# EAGLE schematic d-cube (EAGLE 9.2.1)

## Sheet 1 of 4: Isolation Circuits for USB, Power between the Target and the RPI as well as the power switch for the Target. A 3.3V Voltage for the isolators is also derived from the isolated 5V power.
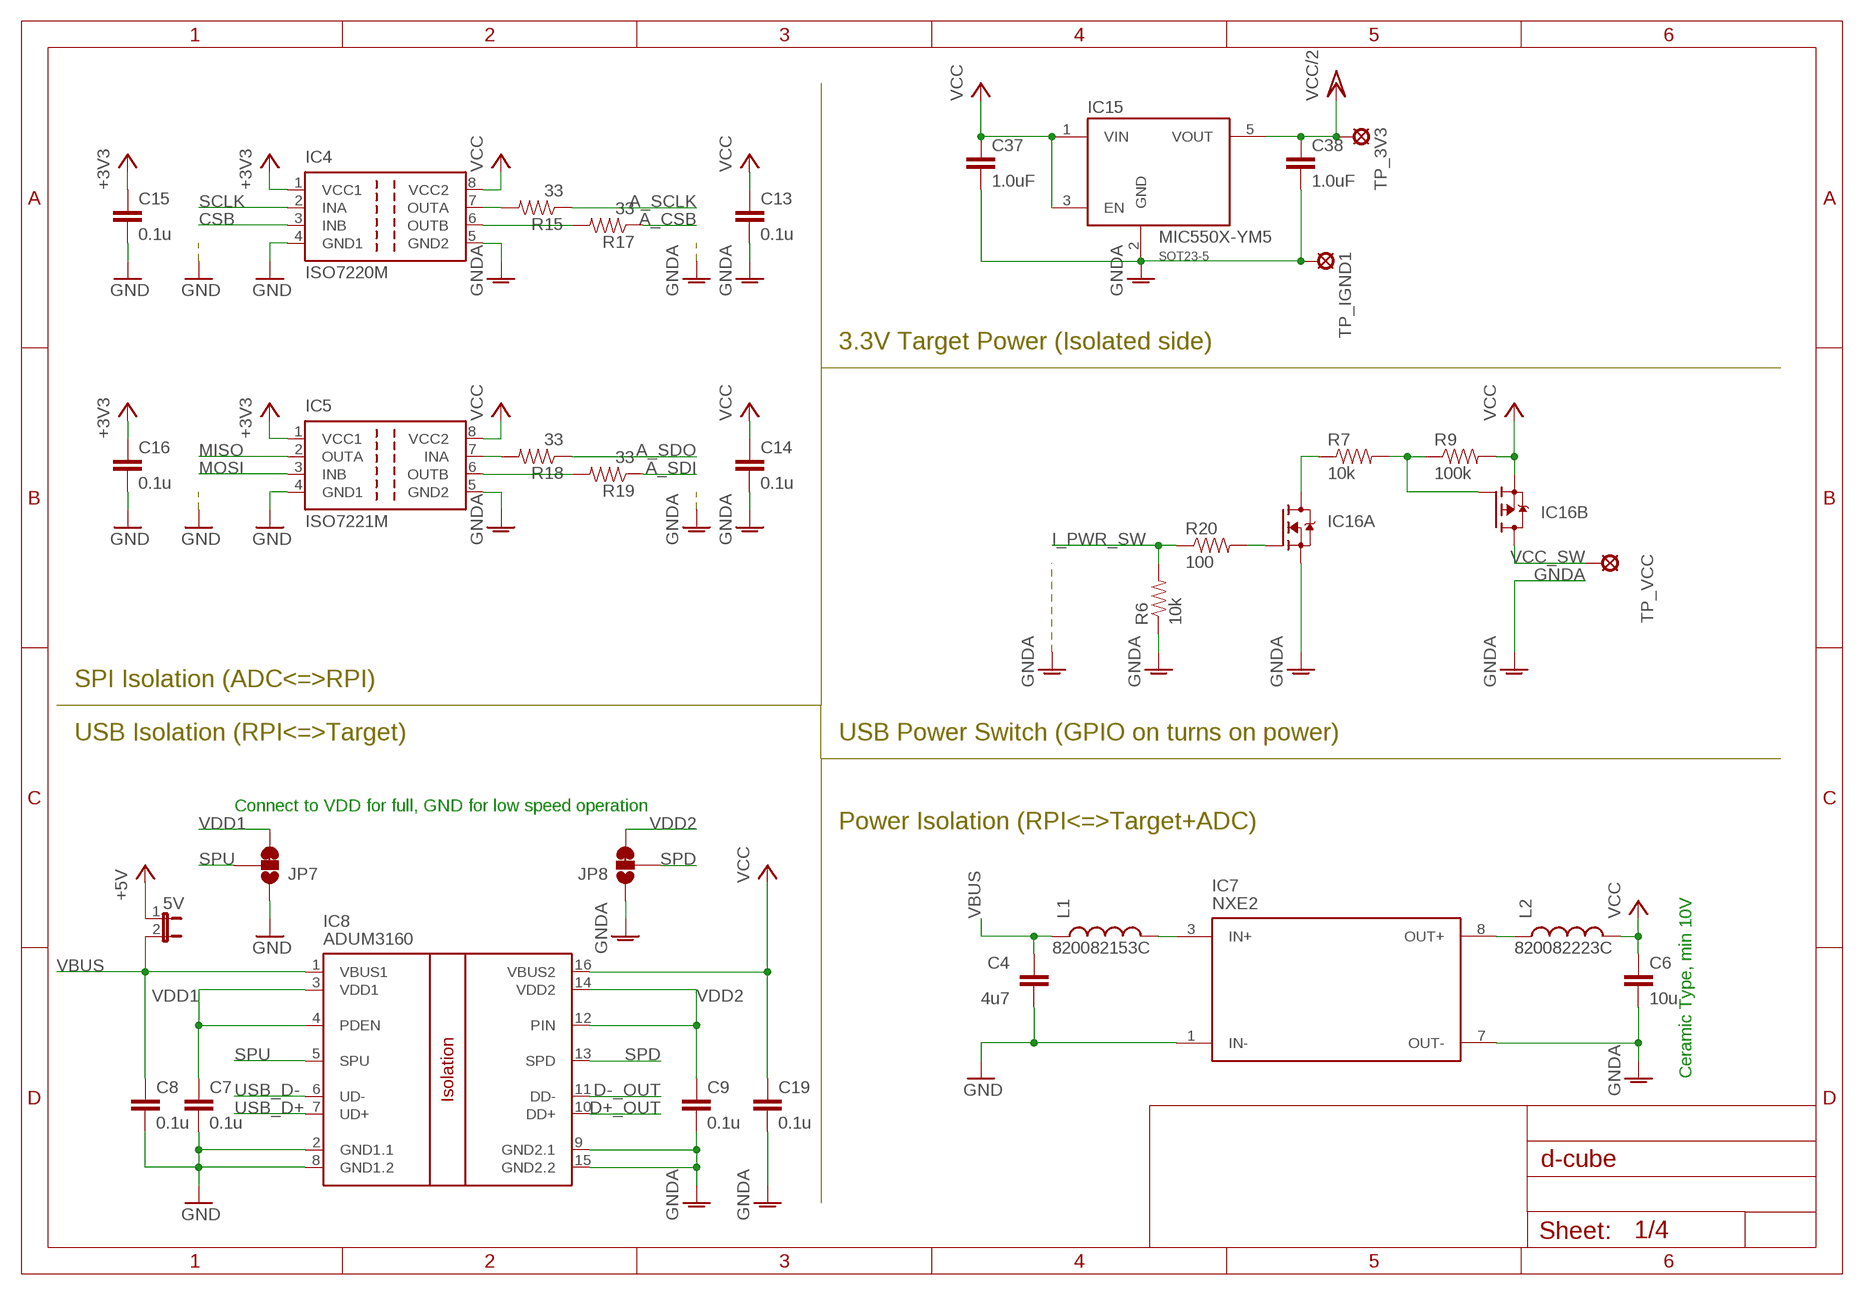
[diagram p0: schematic, sheet 1]

### Parts
5V  JP1E  [JP1]
C4  4u7  CAP0805  [0805]
C6  10u  CAP0805  [0805]
C7  0.1u  CAP0402-CAP  [0402-CAP]
C8  0.1u  CAP0402-CAP  [0402-CAP]
C9  0.1u  CAP0402-CAP  [0402-CAP]
C13  0.1u  CAP0402-CAP  [0402-CAP]
C14  0.1u  CAP0402-CAP  [0402-CAP]
C15  0.1u  CAP0402-CAP  [0402-CAP]
C16  0.1u  CAP0402-CAP  [0402-CAP]
C19  0.1u  CAP0402-CAP  [0402-CAP]
C37  1.0uF  1.0UF-0805-25V-10%  [0805]
C38  1.0uF  1.0UF-0805-25V-10%  [0805]
IC4  ISO7220M  [SO-08]
IC5  ISO7221M  [SO-08]
IC7  NXE2  [NXE2]
IC8  ADUM3160  [SO-16W]
IC15  MIC550X-YM5  [SOT23-5-DBV]
IC16  COMPLEMENTARY  [SOT-363]
JP7  JUMPER-PAD-3-2OF3_NC_BY_TRACE_LARGE  [PAD-JUMPER-3-2OF3_NC_BY_TRACE_YES_SILK_LARGE]
JP8  JUMPER-PAD-3-2OF3_NC_BY_TRACE_LARGE  [PAD-JUMPER-3-2OF3_NC_BY_TRACE_YES_SILK_LARGE]
L1  820082153C  [8200]
L2  820082223C  [8200]
R6  10k  RESISTOR0402-RES  [0402-RES]
R7  10k  RESISTOR0402-RES  [0402-RES]
R9  100k  RESISTOR0402-RES  [0402-RES]
R15  33  RESISTOR0402-RES  [0402-RES]
R17  33  RESISTOR0402-RES  [0402-RES]
R18  33  RESISTOR0402-RES  [0402-RES]
R19  33  RESISTOR0402-RES  [0402-RES]
R20  100  RESISTOR0402-RES  [0402-RES]
TP_3V3  LSP10  [LSP10]
TP_IGND1  LSP10  [LSP10]
TP_VCC  LSP10  [LSP10]

### Nets
+3V3: C15.1 C16.1 IC4.1(VCC1) IC5.1(VCC1) ; also sheet 2,3,4
+5V: 5V.1 ; also sheet 3
A_CSB: R17.1 ; also sheet 2
A_SCLK: R15.1 ; also sheet 2
A_SDI: R19.1 ; also sheet 2
A_SDO: R18.1 ; also sheet 2
CSB: IC4.3(INB) ; also sheet 3
D+_OUT: IC8.10(DD+) ; also sheet 3
D-_OUT: IC8.11(DD-) ; also sheet 3
GND: C4.2 C7.2 C8.2 C15.2 C16.2 IC4.4(GND1) IC5.4(GND1) IC7.1(IN-) IC8.2(GND1.1) IC8.8(GND1.2) JP7.1 ; also sheet 2,3,4
GNDA: C6.2 C9.2 C13.2 C14.2 C19.2 C37.2 C38.2 IC4.5(GND2) IC5.5(GND2) IC7.7(OUT-) IC8.9(GND2.1) IC8.15(GND2.2) IC15.2(GND) IC16.1(A:S) JP8.1 R6.1 TP_IGND1.MP ; also sheet 2,4
I_PWR_SW: R6.2 R20.1 ; also sheet 2
MISO: IC5.2(OUTA) ; also sheet 3
MOSI: IC5.3(INB) ; also sheet 3
N$1: IC7.3(IN+) L1.P$2
N$3: IC16.2(A:G) R20.2
N$4: IC16.5(B:G) R7.2 R9.1
N$5: IC7.8(OUT+) L2.P$1
N$8: IC16.6(A:D) R7.1
N$17: IC4.7(OUTA) R15.2
N$18: IC4.6(OUTB) R17.2
N$19: IC5.7(INA) R18.2
N$20: IC5.6(OUTB) R19.2
SCLK: IC4.2(INA) ; also sheet 3
SPD: IC8.13(SPD) JP8.2
SPU: IC8.5(SPU) JP7.2
USB_D+: IC8.7(UD+) ; also sheet 3
USB_D-: IC8.6(UD-) ; also sheet 3
VBUS: 5V.2 C4.1 C8.1 IC8.1(VBUS1) L1.P$1 ; also sheet 3
VCC: C6.1 C13.1 C14.1 C19.1 C37.1 IC4.8(VCC2) IC5.8(VCC2) IC8.16(VBUS2) IC15.1(VIN) IC15.3(EN) IC16.4(B:S) L2.P$2 R9.2 ; also sheet 2
VCC/2: C38.1 IC15.5(VOUT) TP_3V3.MP ; also sheet 2,4
VCC_SW: IC16.3(B:D) TP_VCC.MP ; also sheet 2,3
VDD1: C7.1 IC8.3(VDD1) IC8.4(PDEN) JP7.3
VDD2: C9.1 IC8.12(PIN) IC8.14(VDD2) JP8.3

### Notes on the sheet
- 3.3V Target Power (Isolated side)
- SPI Isolation (ADC<=>RPI)
- USB Isolation (RPI<=>Target) | USB Power Switch (GPIO on turns on power)
- Connect to VDD for full, GND for low speed operation
- Power Isolation (RPI<=>Target+ADC)
- Ceramic Type, min 10V

## Sheet 2 of 4: Measurement Compoments and Isolation Circuits for GPIO between the Target and the RPI. Contains the main ADC.
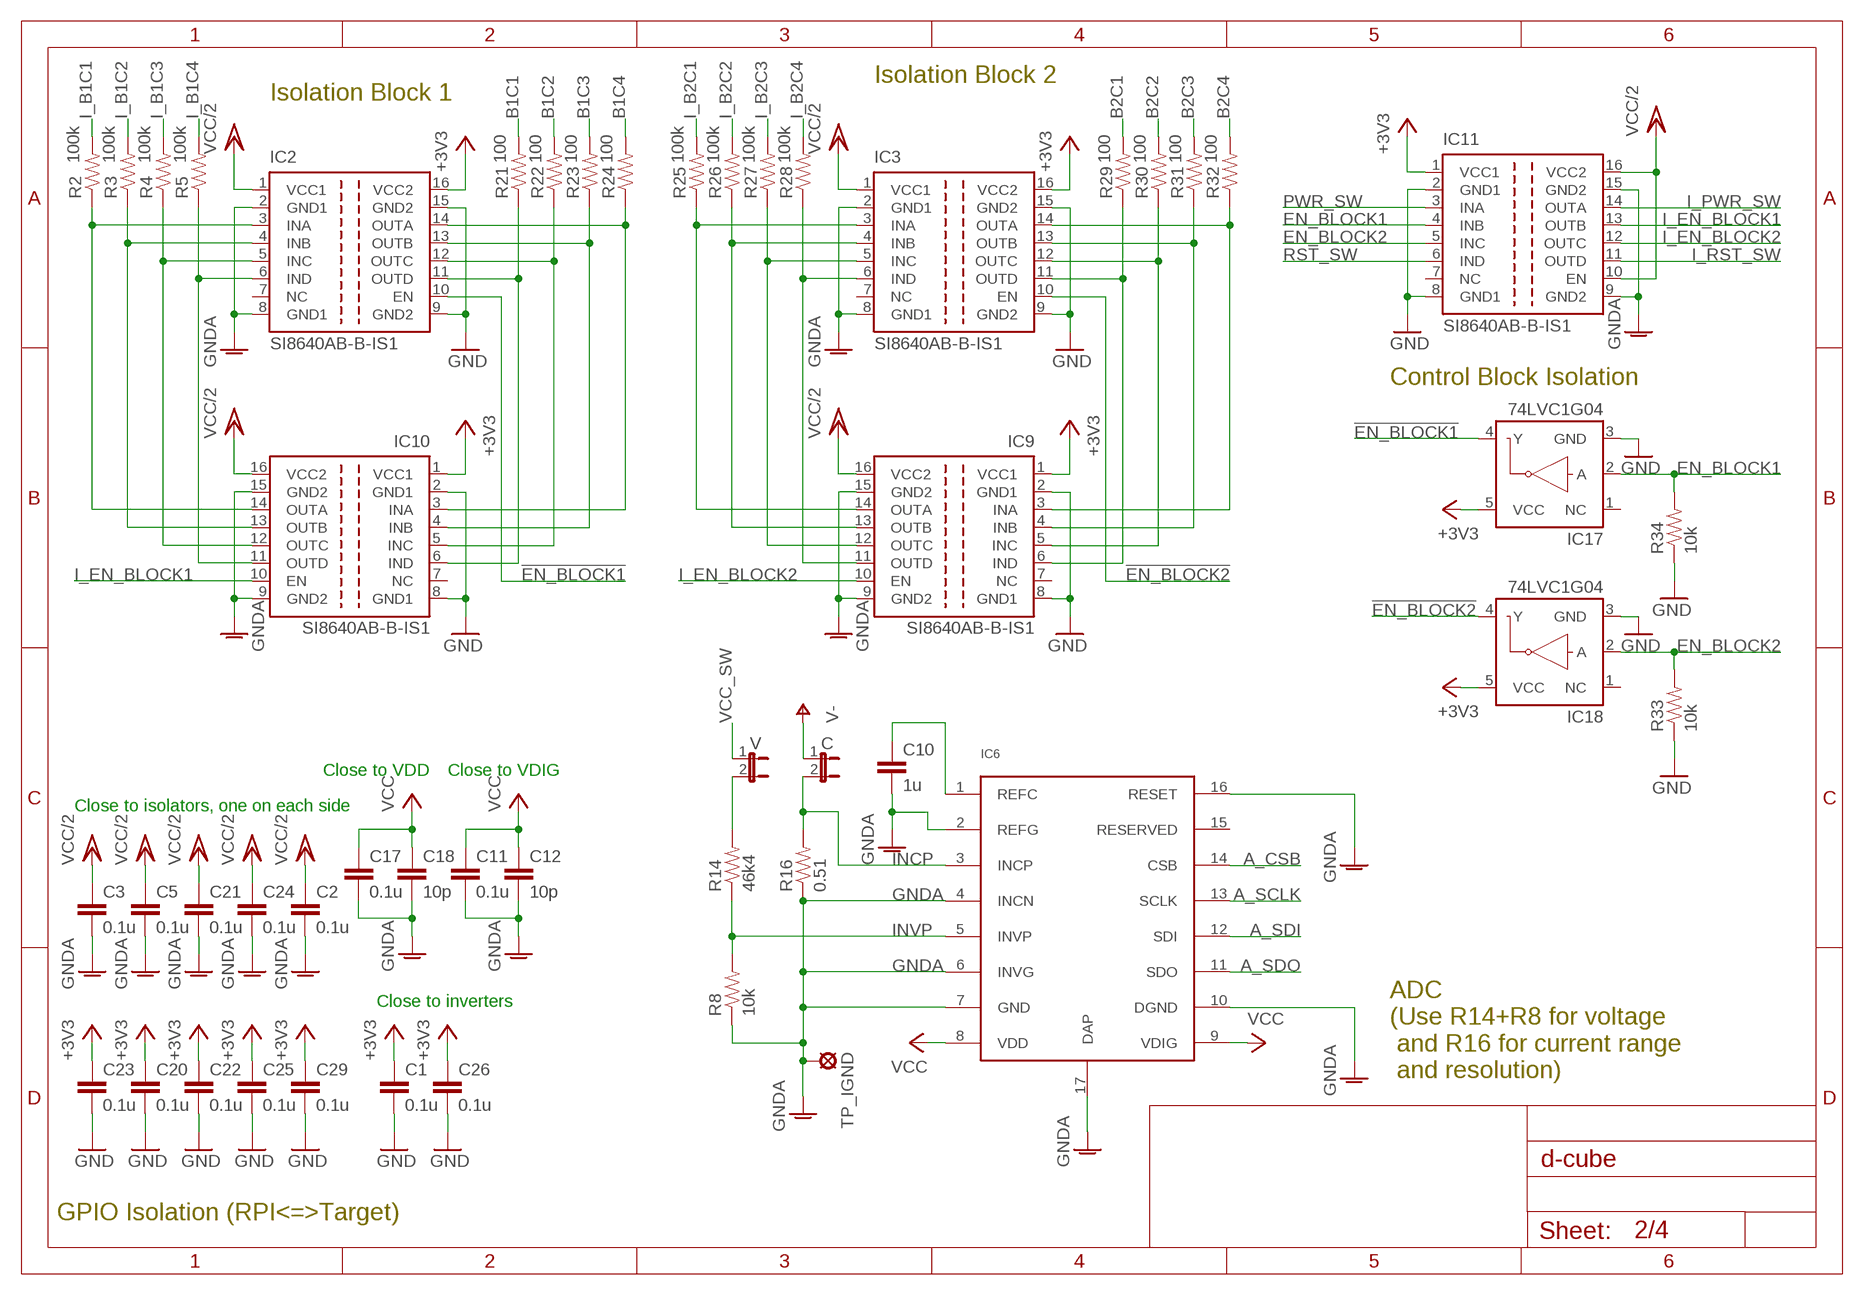
[diagram p1: schematic, sheet 2]

### Parts
C  JP1E  [JP1]
C1  0.1u  CAP0402-CAP  [0402-CAP]
C2  0.1u  CAP0402-CAP  [0402-CAP]
C3  0.1u  CAP0402-CAP  [0402-CAP]
C5  0.1u  CAP0402-CAP  [0402-CAP]
C10  1u  CAP0402-CAP  [0402-CAP]
C11  0.1u  CAP0402-CAP  [0402-CAP]
C12  10p  CAP0402-CAP  [0402-CAP]
C17  0.1u  CAP0402-CAP  [0402-CAP]
C18  10p  CAP0402-CAP  [0402-CAP]
C20  0.1u  CAP0402-CAP  [0402-CAP]
C21  0.1u  CAP0402-CAP  [0402-CAP]
C22  0.1u  CAP0402-CAP  [0402-CAP]
C23  0.1u  CAP0402-CAP  [0402-CAP]
C24  0.1u  CAP0402-CAP  [0402-CAP]
C25  0.1u  CAP0402-CAP  [0402-CAP]
C26  0.1u  CAP0402-CAP  [0402-CAP]
C29  0.1u  CAP0402-CAP  [0402-CAP]
IC2  SI8640AB-B-IS1  [SO-16]
IC3  SI8640AB-B-IS1  [SO-16]
IC6  LMP92064  [WSON-16]
IC9  SI8640AB-B-IS1  [SO-16]
IC10  SI8640AB-B-IS1  [SO-16]
IC11  SI8640AB-B-IS1  [SO-16]
IC17  74LVC1G04  INVERTER_SOT353-5  [SOT353]
IC18  74LVC1G04  INVERTER_SOT353-5  [SOT353]
R2  100k  RESISTOR0402-RES  [0402-RES]
R3  100k  RESISTOR0402-RES  [0402-RES]
R4  100k  RESISTOR0402-RES  [0402-RES]
R5  100k  RESISTOR0402-RES  [0402-RES]
R8  10k  RESISTOR0805-RES  [0805]
R14  46k4  RESISTOR0805-RES  [0805]
R16  0.51  RESISTOR1206  [1206]
R21  100  RESISTOR0402-RES  [0402-RES]
R22  100  RESISTOR0402-RES  [0402-RES]
R23  100  RESISTOR0402-RES  [0402-RES]
R24  100  RESISTOR0402-RES  [0402-RES]
R25  100k  RESISTOR0402-RES  [0402-RES]
R26  100k  RESISTOR0402-RES  [0402-RES]
R27  100k  RESISTOR0402-RES  [0402-RES]
R28  100k  RESISTOR0402-RES  [0402-RES]
R29  100  RESISTOR0402-RES  [0402-RES]
R30  100  RESISTOR0402-RES  [0402-RES]
R31  100  RESISTOR0402-RES  [0402-RES]
R32  100  RESISTOR0402-RES  [0402-RES]
R33  10k  RESISTOR0402-RES  [0402-RES]
R34  10k  RESISTOR0402-RES  [0402-RES]
TP_IGND  LSP10  [LSP10]
V  JP1E  [JP1]

### Nets
!EN_BLOCK1: IC2.10(EN) IC17.4(Y)
!EN_BLOCK2: IC3.10(EN) IC18.4(Y)
+3V3: C1.1 C20.1 C22.1 C23.1 C25.1 C26.1 C29.1 IC2.16(VCC2) IC3.16(VCC2) IC9.1(VCC1) IC10.1(VCC1) IC11.1(VCC1) IC17.5(VCC) IC18.5(VCC) ; also sheet 1,3,4
A_CSB: IC6.14(CSB) ; also sheet 1
A_SCLK: IC6.13(SCLK) ; also sheet 1
A_SDI: IC6.12(SDI) ; also sheet 1
A_SDO: IC6.11(SDO) ; also sheet 1
B1C1: R21.2 ; also sheet 3
B1C2: R22.2 ; also sheet 3
B1C3: R23.2 ; also sheet 3
B1C4: R24.2 ; also sheet 3
B2C1: R29.2 ; also sheet 3
B2C2: R30.2 ; also sheet 3
B2C3: R31.2 ; also sheet 3
B2C4: R32.2 ; also sheet 3
EN_BLOCK1: IC11.4(INB) IC17.2(A) R34.2 ; also sheet 3
EN_BLOCK2: IC11.5(INC) IC18.2(A) R33.2 ; also sheet 3
GND: C1.2 C20.2 C22.2 C23.2 C25.2 C26.2 C29.2 IC2.9(GND2) IC2.15(GND2) IC3.9(GND2) IC3.15(GND2) IC9.2(GND1) IC9.8(GND1) IC10.2(GND1) IC10.8(GND1) IC11.2(GND1) IC11.8(GND1) IC17.3(GND) IC18.3(GND) R33.1 R34.1 ; also sheet 1,3,4
GNDA: C2.2 C3.2 C5.2 C10.2 C11.2 C12.2 C17.2 C18.2 C21.2 C24.2 IC2.2(GND1) IC2.8(GND1) IC3.2(GND1) IC3.8(GND1) IC6.2(REFG) IC6.4(INCN) IC6.6(INVG) IC6.7(GND) IC6.10(DGND) IC6.16(RESET) IC6.17(DAP) IC9.9(GND2) IC9.15(GND2) IC10.9(GND2) IC10.15(GND2) IC11.9(GND2) IC11.15(GND2) R8.1 R16.1 TP_IGND.MP ; also sheet 1,4
I_B1C1: R2.2 ; also sheet 3
I_B1C2: R3.2 ; also sheet 3
I_B1C3: R4.2 ; also sheet 3
I_B1C4: R5.2 ; also sheet 3
I_B2C1: R25.2 ; also sheet 3
I_B2C2: R26.2 ; also sheet 3
I_B2C3: R27.2 ; also sheet 3
I_B2C4: R28.2 ; also sheet 3
I_EN_BLOCK1: IC10.10(EN) IC11.13(OUTB)
I_EN_BLOCK2: IC9.10(EN) IC11.12(OUTC)
I_PWR_SW: IC11.14(OUTA) ; also sheet 1
I_RST_SW: IC11.11(OUTD) ; also sheet 3
INCP: C.2 IC6.3(INCP) R16.2
INVP: IC6.5(INVP) R8.2 R14.1
N$2: IC2.3(INA) IC10.14(OUTA) R2.1
N$6: IC2.14(OUTA) IC10.3(INA) R24.1
N$7: IC2.13(OUTB) IC10.4(INB) R23.1
N$11: IC2.12(OUTC) IC10.5(INC) R22.1
N$12: IC3.3(INA) IC9.14(OUTA) R25.1
N$13: IC2.6(IND) IC10.11(OUTD) R5.1
N$14: IC2.5(INC) IC10.12(OUTC) R4.1
N$15: IC2.4(INB) IC10.13(OUTB) R3.1
N$16: C10.1 IC6.1(REFC)
N$21: IC2.11(OUTD) IC10.6(IND) R21.1
N$22: R14.2 V.2
N$23: IC3.6(IND) IC9.11(OUTD) R28.1
N$24: IC3.5(INC) IC9.12(OUTC) R27.1
N$25: IC3.4(INB) IC9.13(OUTB) R26.1
N$26: IC3.14(OUTA) IC9.3(INA) R32.1
N$27: IC3.13(OUTB) IC9.4(INB) R31.1
N$28: IC3.12(OUTC) IC9.5(INC) R30.1
N$29: IC3.11(OUTD) IC9.6(IND) R29.1
PWR_SW: IC11.3(INA) ; also sheet 3
RST_SW: IC11.6(IND) ; also sheet 3
V-: C.1 ; also sheet 3
VCC: C11.1 C12.1 C17.1 C18.1 IC6.8(VDD) IC6.9(VDIG) ; also sheet 1
VCC/2: C2.1 C3.1 C5.1 C21.1 C24.1 IC2.1(VCC1) IC3.1(VCC1) IC9.16(VCC2) IC10.16(VCC2) IC11.10(EN) IC11.16(VCC2) ; also sheet 1,4
VCC_SW: V.1 ; also sheet 1,3
Unconnected: IC2.7(NC) IC3.7(NC) IC6.15(RESERVED) IC9.7(NC) IC10.7(NC) IC11.7(NC) IC17.1(NC) IC18.1(NC)

### Notes on the sheet
- Isolation Block 2
- Isolation Block 1
- Control Block Isolation
- Close to VDD | Close to VDIG
- Close to isolators, one on each side
- Close to inverters
- ADC
  (Use R14+R8 for voltage
   and R16 for current range
   and resolution)
- GPIO Isolation (RPI<=>Target)

## Sheet 3 of 4: RPI/NavSpark/Target Connectors
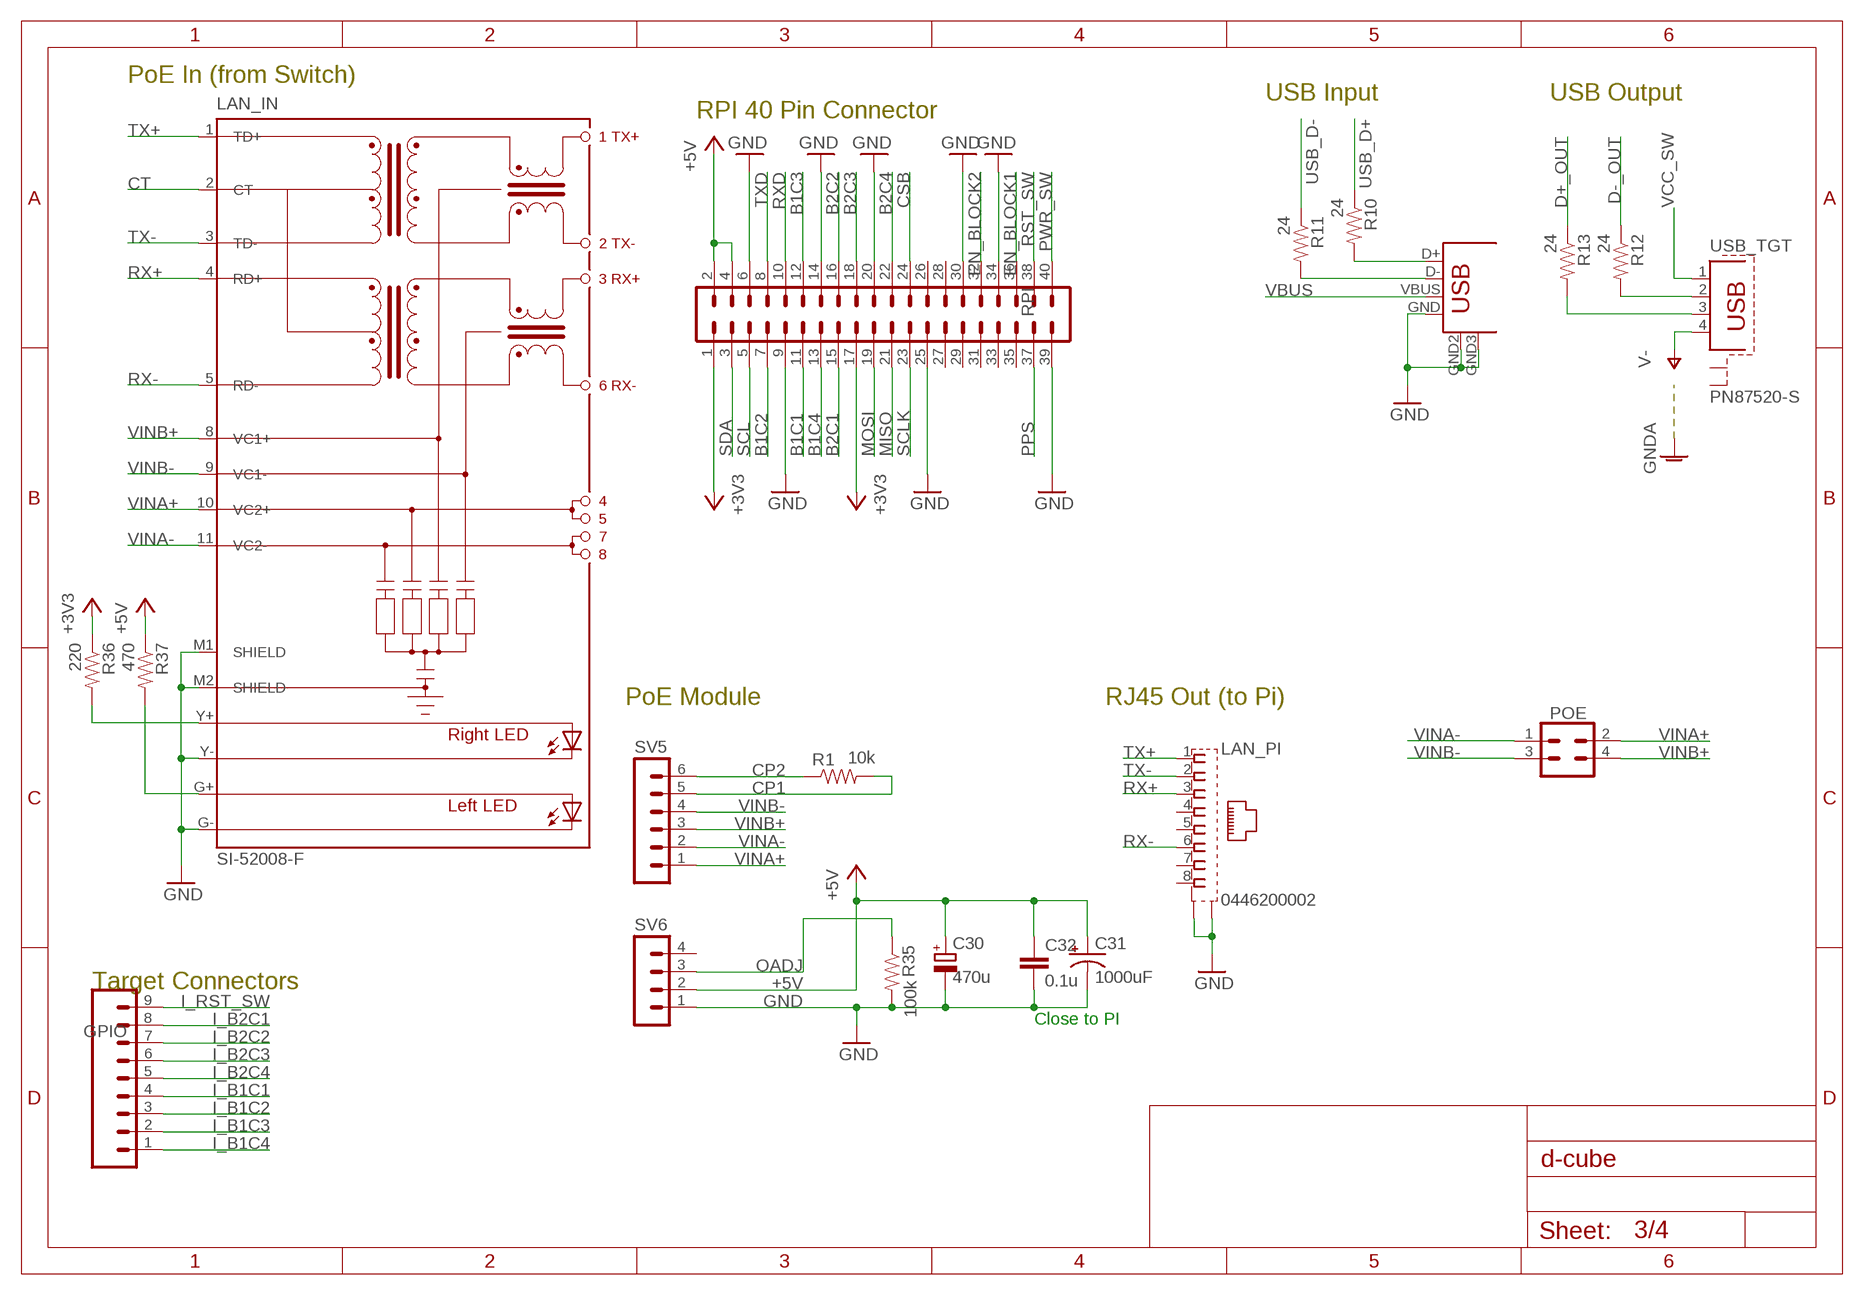
[diagram p2: schematic, sheet 3]

### Parts
C30  470u  CPOL-EUCT7343  [CT7343]
C31  1000uF  560UF-PANASONIC_G-25V-20%  [PANASONIC_G]
C32  0.1u  CAP0805  [0805]
GPIO  CONN_09NO_SILK  [1X09_NO_SILK]
LAN_IN  SI-52008-F  [POE]
LAN_PI  0446200002  [0446200002]
POE  CONN_02X2  [2X02_NO_SILK]
R1  10k  RESISTOR0402-RES  [0402-RES]
R10  24  RESISTOR0402-RES  [0402-RES]
R11  24  RESISTOR0402-RES  [0402-RES]
R12  24  RESISTOR0402-RES  [0402-RES]
R13  24  RESISTOR0402-RES  [0402-RES]
R35  100k  RESISTOR0402-RES  [0402-RES]
R36  220  RESISTOR0402-RES  [0402-RES]
R37  470  RESISTOR0402-RES  [0402-RES]
RPI  MA20-2  [MA20-2]
SV5  MA06-1  [MA06-1]
SV6  MA04-1  [MA04-1]
USB_PI  USB+SHIELDUSB-A-H-S  [USB-A-H]
USB_TGT  PN87520-S  [PN87520-S]

### Nets
+3V3: R36.1 RPI.1 RPI.17 ; also sheet 1,2,4
+5V: C30.+ C31.+ C32.1 R37.1 RPI.2 RPI.4 SV6.2 ; also sheet 1
B1C1: RPI.11 ; also sheet 2
B1C2: RPI.7 ; also sheet 2
B1C3: RPI.12 ; also sheet 2
B1C4: RPI.13 ; also sheet 2
B2C1: RPI.15 ; also sheet 2
B2C2: RPI.16 ; also sheet 2
B2C3: RPI.18 ; also sheet 2
B2C4: RPI.22 ; also sheet 2
CP1: R1.2 SV5.5
CP2: R1.1 SV5.6
CSB: RPI.24 ; also sheet 1
CT: LAN_IN.2(CT)
D+_OUT: R13.1 ; also sheet 1
D+_OUT_TERM: R13.2 USB_TGT.3
D-_OUT: R12.1 ; also sheet 1
D-_OUT_TERM: R12.2 USB_TGT.2
EN_BLOCK1: RPI.36 ; also sheet 2
EN_BLOCK2: RPI.32 ; also sheet 2
GND: C30.- C31.- C32.2 LAN_IN.G-(C-L) LAN_IN.M1(SHIELD) LAN_IN.M2(SHIELD) LAN_IN.Y-(C-R) LAN_PI.S@1(S1) LAN_PI.S@2(S2) R35.2 RPI.6 RPI.9 RPI.14 RPI.20 RPI.25 RPI.30 RPI.34 RPI.39 SV6.1 USB_PI.GND USB_PI.GND2(S1) USB_PI.GND3(S2) ; also sheet 1,2,4
I_B1C1: GPIO.4 ; also sheet 2
I_B1C2: GPIO.3 ; also sheet 2
I_B1C3: GPIO.2 ; also sheet 2
I_B1C4: GPIO.1 ; also sheet 2
I_B2C1: GPIO.8 ; also sheet 2
I_B2C2: GPIO.7 ; also sheet 2
I_B2C3: GPIO.6 ; also sheet 2
I_B2C4: GPIO.5 ; also sheet 2
I_RST_SW: GPIO.9 ; also sheet 2
MISO: RPI.21 ; also sheet 1
MOSI: RPI.19 ; also sheet 1
N$9: LAN_IN.Y+(A-R) R36.2
N$10: LAN_IN.G+(A-L) R37.2
OADJ: R35.1 SV6.3
PPS: RPI.37 ; also sheet 4
PWR_SW: RPI.40 ; also sheet 2
RST_SW: RPI.38 ; also sheet 2
RX+: LAN_IN.4(RD+) LAN_PI.3
RX-: LAN_IN.5(RD-) LAN_PI.6
RXD: RPI.10 ; also sheet 4
SCL: RPI.5 ; also sheet 4
SCLK: RPI.23 ; also sheet 1
SDA: RPI.3 ; also sheet 4
TX+: LAN_IN.1(TD+) LAN_PI.1
TX-: LAN_IN.3(TD-) LAN_PI.2
TXD: RPI.8 ; also sheet 4
USB_D+: R10.1 ; also sheet 1
USB_D+_TERM: R10.2 USB_PI.D+
USB_D-: R11.1 ; also sheet 1
USB_D-_TERM: R11.2 USB_PI.D-
V-: USB_TGT.4 ; also sheet 2
VBUS: USB_PI.VBUS ; also sheet 1
VCC_SW: USB_TGT.1 ; also sheet 1,2
VINA+: LAN_IN.10(VC2+) POE.2 SV5.1
VINA-: LAN_IN.11(VC2-) POE.1 SV5.2
VINB+: LAN_IN.8(VC1+) POE.4 SV5.3
VINB-: LAN_IN.9(VC1-) POE.3 SV5.4
Unconnected: LAN_PI.4 LAN_PI.5 LAN_PI.7 LAN_PI.8 RPI.26 RPI.27 RPI.28 RPI.29 RPI.31 RPI.33 RPI.35 SV6.4 USB_TGT.S1 USB_TGT.S2

### Notes on the sheet
- PoE In (from Switch)
- USB Input | USB Output
- RPI 40 Pin Connector
- PoE Module | RJ45 Out (to Pi)
- Target Connectors
- Close to PI

## Sheet 4 of 4: Communication Mailbox EEPROM and GPS module
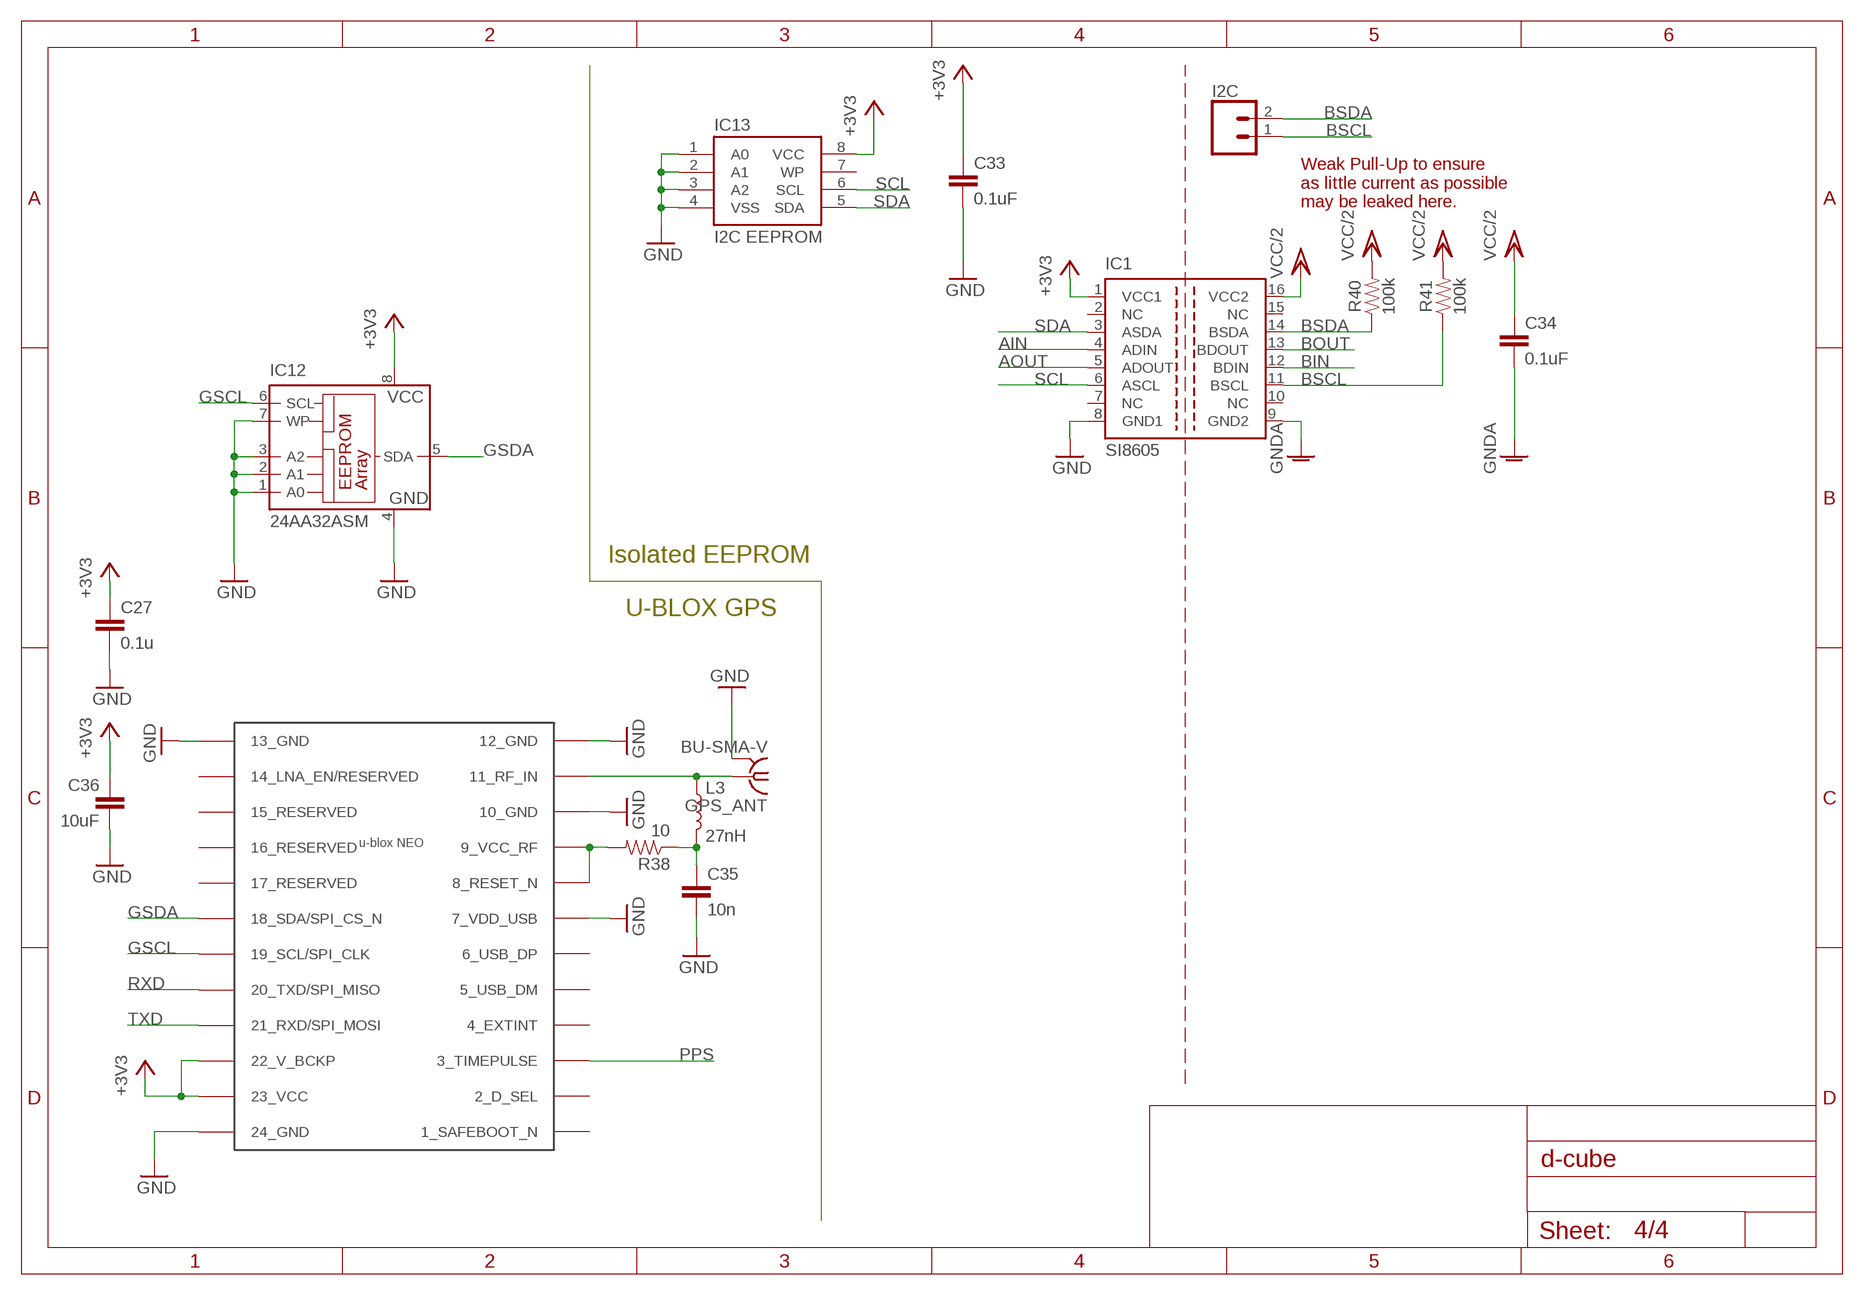
[diagram p3: schematic, sheet 4]

### Parts
C27  0.1u  CAP0402-CAP  [0402-CAP]
C33  0.1uF  0.1UF-0402-16V-10%  [0402]
C34  0.1uF  0.1UF-0402-16V-10%  [0402]
C35  10n  CAP0805  [0805]
C36  10uF  10UF-0805-10V-10%  [0805]
GPS_ANT  BU-SMA-V  [BU-SMA-V]
I2C  CONN_021X02_NO_SILK  [1X02_NO_SILK]
IC1  SI8605  [SO-16]
IC12  24AA32ASM  [SO-08M]
IC13  I2C EEPROM  EEPROM-I2CEIAJ  [SO08-EIAJ]
IC14  NEO-M8  [NEO-M8]
L3  27nH  INDUCTOR-0402-3.9NH  [0402]
R38  10  RESISTOR0402-RES  [0402-RES]
R40  100k  RESISTOR0402  [0402]
R41  100k  RESISTOR0402  [0402]

### Nets
+3V3: C27.1 C33.1 C36.1 IC1.1(VCC1) IC12.8(VCC) IC13.8(VCC) IC14.22(22_V_BCKP) IC14.23(23_VCC) ; also sheet 1,2,3
AIN: IC1.4(ADIN)
AOUT: IC1.5(ADOUT)
BIN: IC1.12(BDIN)
BOUT: IC1.13(BDOUT)
BSCL: I2C.1 IC1.11(BSCL) R41.1
BSDA: I2C.2 IC1.14(BSDA) R40.1
GND: C27.2 C33.2 C35.2 C36.2 GPS_ANT.2(GND) IC1.8(GND1) IC12.1(A0) IC12.2(A1) IC12.3(A2) IC12.4(GND) IC12.7(WP) IC13.1(A0) IC13.2(A1) IC13.3(A2) IC13.4(VSS) IC14.7(7_VDD_USB) IC14.10(10_GND) IC14.12(12_GND) IC14.13(13_GND) IC14.24(24_GND) ; also sheet 1,2,3
GNDA: C34.2 IC1.9(GND2) ; also sheet 1,2
GPS_SIG: GPS_ANT.1 IC14.11(11_RF_IN) L3.1
GSCL: IC12.6(SCL) IC14.19(19_SCL/SPI_CLK)
GSDA: IC12.5(SDA) IC14.18(18_SDA/SPI_CS_N)
N$30: IC14.8(8_RESET_N) IC14.9(9_VCC_RF) R38.2
N$32: C35.1 L3.2 R38.1
PPS: IC14.3(3_TIMEPULSE) ; also sheet 3
RXD: IC14.20(20_TXD/SPI_MISO) ; also sheet 3
SCL: IC1.6(ASCL) IC13.6(SCL) ; also sheet 3
SDA: IC1.3(ASDA) IC13.5(SDA) ; also sheet 3
TXD: IC14.21(21_RXD/SPI_MOSI) ; also sheet 3
VCC/2: C34.1 IC1.16(VCC2) R40.2 R41.2 ; also sheet 1,2
Unconnected: IC1.2(NC) IC1.7(NC) IC1.10(NC) IC1.15(NC) IC13.7(WP) IC14.1(1_SAFEBOOT_N) IC14.2(2_D_SEL) IC14.4(4_EXTINT) IC14.5(5_USB_DM) IC14.6(6_USB_DP) IC14.14(14_LNA_EN/RESERVED) IC14.15(15_RESERVED) IC14.16(16_RESERVED) IC14.17(17_RESERVED)

### Notes on the sheet
- Weak Pull-Up to ensure
  as little current as possible
  may be leaked here.
- Isolated EEPROM
- U-BLOX GPS

## Power pins joined to a net without a drawn wire
GND: GPS_ANT.3(GND) GPS_ANT.4(GND) GPS_ANT.5(GND)

## Library data of the parts
5V C V = jumper:JP1E: JUMPER
C1-C27 C29 C32 C35 = SparkFun-Passives:CAP: Capacitor Standard 0603 ceramic capacitor, and 0.1" leaded capacitor.
C30 = rcl:CPOL-EU: POLARIZED CAPACITOR, European symbol
C31 = SparkFun-Capacitors:560UF: 560µF polarized capacitors A capacitor is a passive two-terminal electrical component used to store electrical energy temporarily in an electric field.; PROD_ID: CAP-09983; VALUE: 560uF
C33 C34 = SparkFun-Capacitors:0.1UF: 0.1µF ceramic capacitors A capacitor is a passive two-terminal electrical component used to store electrical energy temporarily in an electric field.; PROD_ID: CAP-12416
C36 = SparkFun-Capacitors:10UF: 10.0µF ceramic capacitors A capacitor is a passive two-terminal electrical component used to store electrical energy temporarily in an electric field.; PROD_ID: CAP-11330
C37 C38 = SparkFun-Capacitors:1.0UF: 1µF ceramic capacitors A capacitor is a passive two-terminal electrical component used to store electrical energy temporarily in an electric field.; PROD_ID: CAP-08064
GPIO = SparkFun-Connectors:CONN_09: Multi connection point. Often used as Generic Header-pin footprint for 0.1 inch spaced/style header connections On any of the 0.1 inch spaced packages, you can populate with these: Break Away Headers - Straight <https://www.sparkfun.com/products/116> (PRT-00116) Break Away Male Headers - Right Angle <https://www.sparkfun.com/products/553> (PRT-00553) Female Headers <https://www.sparkfun.com/products/115> (PRT-00115) Break Away Headers - Machine Pin <https://www.sparkfun.com/products/117> (PRT-00117) Break Away Female Headers - Swiss Machine Pin <https://www.sparkfun.com/products/743> (PRT-00743) For SCREWTERMINALS and SPRING TERMINALS visit here: Screw Terimnals on SparkFun.com <https://www.sparkfun.com/search/results?term=Screw+Terminals> (5mm/3.5mm/2.54mm spacing) This device is also useful as a general connection point to wire up your design to another part of your project. Our various solder wires solder well into these plated through hole pads. Hook-Up Wire - Assortment (Stranded, 22 AWG) <https://www.sparkfun.com/products/11375> (PRT-11375) Hook-Up Wire - Assortment (Solid Core, 22 AWG) <https://www.sparkfun.com/products/11367> (PRT-11367) View the entire wire category on our website here <https://www.sparkfun.com/categories/141> Special notes: Molex polarized connector foot print use with SKU : PRT-08231 with associated crimp pins and housings. 1MM SMD Version SKU: PRT-10208 NOTES ON THE VARIANTS LOCK and LOCK_LONGPADS... This footprint was designed to help hold the alignment of a through-hole component (i.e. 6-pin header) while soldering it into place. You may notice that each hole has been shifted either up or down by 0.005 of an inch from it's more standard position (which is a perfectly straight line). This slight alteration caused the pins (the squares in the middle) to touch the edges of the holes. Because they are alternating, it causes a "brace" to hold the component in place. 0.005 has proven to be the perfect amount of "off-center" position when using our standard breakaway headers. Although looks a little odd when you look at the bare footprint, once you have a header in there, the alteration is very hard to notice. Also,if you push a header all the way into place, it is covered up entirely on the bottom side.
GPS_ANT = con-coax:BU-SMA-V: FEMALE SMA CONNECTOR Radiall distributor RS 112-3794; OC_FARNELL: unknown; OC_NEWARK: unknown
I2C = SparkFun-Connectors:CONN_02: Multi connection point. Often used as Generic Header-pin footprint for 0.1 inch spaced/style header connections On any of the 0.1 inch spaced packages, you can populate with these: Break Away Headers - Straight <https://www.sparkfun.com/products/116> (PRT-00116) Break Away Male Headers - Right Angle <https://www.sparkfun.com/products/553> (PRT-00553) Female Headers <https://www.sparkfun.com/products/115> (PRT-00115) Break Away Headers - Machine Pin <https://www.sparkfun.com/products/117> (PRT-00117) Break Away Female Headers - Swiss Machine Pin <https://www.sparkfun.com/products/743> (PRT-00743) For SCREWTERMINALS and SPRING TERMINALS visit here: Screw Terimnals on SparkFun.com <https://www.sparkfun.com/search/results?term=Screw+Terminals> (5mm/3.5mm/2.54mm spacing) This device is also useful as a general connection point to wire up your design to another part of your project. Our various solder wires solder well into these plated through hole pads. Hook-Up Wire - Assortment (Stranded, 22 AWG) <https://www.sparkfun.com/products/11375> (PRT-11375) Hook-Up Wire - Assortment (Solid Core, 22 AWG) <https://www.sparkfun.com/products/11367> (PRT-11367) View the entire wire category on our website here <https://www.sparkfun.com/categories/141> Special notes: Molex polarized connector foot print use with: PRT-08233 with associated crimp pins and housings. 2.54_SCREWTERM for use with PRT-10571. 3.5mm Screw Terminal footprints for PRT-08084 5mm Screw Terminal footprints for use with PRT-08432
IC1 = silabslbr:SI8605: HIGH SPEED QUAD DIGITAL ISOLATORS Source: http://focus.ti.com/lit/ds/symlink/iso7240m.pdf
IC2 IC3 IC9-IC11 = silabslbr:SI8640: HIGH SPEED QUAD DIGITAL ISOLATORS Source: http://focus.ti.com/lit/ds/symlink/iso7240m.pdf
IC4 = texas:ISO7220: DUAL DIGITAL ISOLATORS Source: http://focus.ti.com/lit/ds/symlink/iso7221a.pdf; MPN: ISO7220MD; OC_FARNELL: 1390646; OC_NEWARK: 61M6991
IC5 = texas:ISO7221: DUAL DIGITAL ISOLATORS Source: http://focus.ti.com/lit/ds/symlink/iso7221a.pdf; MPN: ISO7221MD; OC_FARNELL: 1390647; OC_NEWARK: 48M0676
IC6 = LMP9264:LMP92064
IC7 = nx2:NXE2
IC8 = adum3160:ADUM3160
IC12 = microchip:24*: Serial EEPROM I2C; MF: MICROCHIP; MPN: 24AA32A-I/SN; OC_FARNELL: 1617659; OC_NEWARK: 83C5815
IC13 = SparkFun-IC-Memory:EEPROM-I2C: I2C EEPROMs, 24LC256 and others 24LC256 Series 256 kb I2C 2 Wire (32 k x 8 Bit) 2.5 V Serial EEPROM SMD - SOIC-8 Datasheet SparkFun Products SparkFun UDB5 - PIC UAV Development Board <https://www.sparkfun.com/products/11703> (GPS-11703); PROD_ID: NA-XXXXX
IC14 = ubloxLib:NEO-M8: u-blox NEO GNSS module
IC15 = borkedlabs-powerics:MIC550X; PACKAGE: SOT23-5
IC16 = mos:COMPLEMENTARY
IC17 IC18 = SparkFun-DigitalIC:INVERTER: Single inverter, SOT23-5; PROD_ID: IC-10843
JP7 JP8 = SparkFun-Passives:JUMPER-PAD-3-2OF3_NC_BY_TRACE
L1 L2 = 8200:8200
L3 = SparkFun-Coils:INDUCTOR: Inductors Resist changes in electrical current. Basically a coil of wire. SparkFun Products: SparkFun Load Cell Amplifier - HX711 <https://www.sparkfun.com/products/13879> IOIO-OTG - V2.2 <https://www.sparkfun.com/products/13613>; PROD_ID: NDUC-13457; VALUE: 3.9NH
LAN_IN = con-pulse:SI-52008-F
LAN_PI = con-molex:0446200002: RJ-45 INVERTED MODULAR JACK ASSEMBLY WITH RJ-11 KEEPOUT FEATURE Source: Data sheet <http://www.farnell.com/datasheets/73207.pdf> MOLEX 0446200002 BUCHSE, RJ45, GESCHIRMT Source: Farnell <http://de.farnell.com/molex/0446200002/buchse-rj45-geschirmt/dp/9251910?ost=9251910>; MF: MOLEX; MPN: 0446200002; OC_FARNELL: 9251910
POE = my-con:CONN_02X2: Multi connection point. Often used as Generic Header-pin footprint for 0.1 inch spaced/style header connections You can populate with any combo of single row headers, but if you'd like an exact match, check these: Header - 2x3 (Male, 0.1") <https://www.sparkfun.com/products/12807> (PRT-12807) Header - 2x3 (Female, 0.1") <https://www.sparkfun.com/products/13010> (PRT-13010) 2x3 Pin Shrouded Header <https://www.sparkfun.com/products/10877> (PRT-10877) On any of the 0.1 inch spaced packages, you can populate with these: Break Away Headers - Straight <https://www.sparkfun.com/products/116> (PRT-00116) Break Away Male Headers - Right Angle <https://www.sparkfun.com/products/553> (PRT-00553) Female Headers <https://www.sparkfun.com/products/115> (PRT-00115) Break Away Headers - Machine Pin <https://www.sparkfun.com/products/117> (PRT-00117) Break Away Female Headers - Swiss Machine Pin <https://www.sparkfun.com/products/743> (PRT-00743) Special note: the shrouded connector mates well with our 3x2 ribbon cables: Ribbon Crimp Connector - 6-pin (2x3, Female) <https://www.sparkfun.com/products/10651> (PRT-10651) Ribbon Cable - 6 wire (15ft) <https://www.sparkfun.com/products/10646> (PRT-10646)
R1-R38 = SparkFun-Passives:RESISTOR: Resistor Basic schematic elements and footprints for 0603, 1206, and PTH resistors.
R40 R41 = SparkFun-Resistors:RESISTOR: Generic Resistor Package
RPI = con-lstb:MA20-2: PIN HEADER; OC_FARNELL: unknown; OC_NEWARK: unknown
SV5 = con-lstb:MA06-1: PIN HEADER; OC_FARNELL: unknown; OC_NEWARK: unknown
SV6 = con-lstb:MA04-1: PIN HEADER; OC_FARNELL: unknown; OC_NEWARK: unknown
TP_3V3 TP_IGND TP_IGND1 TP_VCC = solpad:LSP10: SOLDER PAD drill 1.0 mm, distributor Buerklin, 12H555
USB_PI = SparkFun-Connectors:USB+SHIELD: USB+Shield USB connector with shield pins connectable
USB_TGT = con-berg:PN87520-S; OC_FARNELL: unknown; OC_NEWARK: unknown